# Altium schematic sheet LPCB234 - CAN.SchDoc
size A3; Address1: Factory 10; Address2: 9-13 Dingley Avenue, Dandeong, VICTORIA 3175, AUSTRALIA; DocumentNumber: 5; Revision: 1; SheetNumber: 5; SheetTotal: 10; Lockie__PCB_SUB_ASSEMBLY: CAN Interface; Lockie__PCB_ASSEMBLY: Main; Lockie__LDL: LPCB234; Lockie__PCB_DESCRIPTION: RM4 Power Node
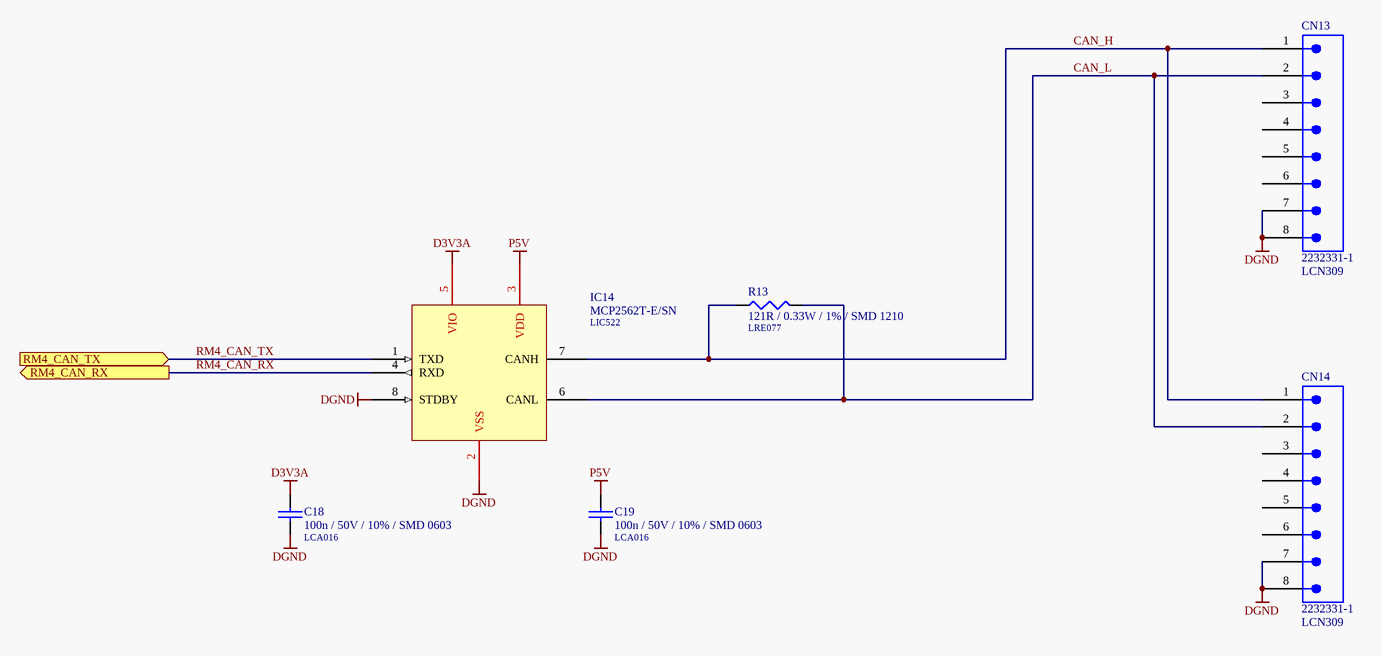
[diagram p0: LPCB234 - CAN.SchDoc]

## Parts
C18  100n / 50V / 10% / SMD 0603  LDL_NUMBER: LCA016  [LFP011__CC1608-0603-IPC7351_B]
C19  100n / 50V / 10% / SMD 0603  LDL_NUMBER: LCA016  [LFP011__CC1608-0603-IPC7351_B]
CN13  2232331-1  LDL_NUMBER: LCN309  [2232331-1]
CN14  2232331-1  LDL_NUMBER: LCN309  [2232331-1]
IC14  MCP2562T-E/SN  LDL_NUMBER: LIC522  [LFP017__SO-G8/Y1.9]
R13  121R / 0.33W / 1% / SMD 1210  LDL_NUMBER: LRE077  [LFP028__CR3225-1210]

## Ports
RM4_CAN_RX (out), RM4_CAN_TX (in)

## Nets
D3V3A: C18.1 IC14.5(VIO)
DGND: C18.2 C19.2 CN13.7 CN13.8 CN14.7 CN14.8 IC14.2(VSS) IC14.8(STDBY)
P5V: C19.1 IC14.3(VDD)
CAN_H: CN13.1 CN14.1 IC14.7(CANH) R13.1
CAN_L: CN13.2 CN14.2 IC14.6(CANL) R13.2
RM4_CAN_RX: IC14.4(RXD) ; port RM4_CAN_RX
RM4_CAN_TX: IC14.1(TXD) ; port RM4_CAN_TX

Not connected (* = marked no-connect by the designer): CN13 3 4 5 6; CN14 3 4 5 6

## Notes on the sheet
- PCB COMPONENT DESCRIPTION
- LDL NUMBER
- Assembly Details
- Size
- Drawing File Name
- Revision
- http://rloop.org
- Scale
- A3
- Sheet Details
- N.T.S
- Sheet:
- Of:

## Library data of the parts
C18 C19 = 100n / 50V / 10% / SMD 0603: Capacitor, Ceramic Chip, 100nF (0.1uF), 50V, 5%, SMD 0603 [LCA016]; FMEDA__OPERATING__VOLTAGE_MIN: 0; FMEDA__OPERATING__VOLTAGE_MAX: 3.3; FMEDA__OPERATING__TEMP_MIN: -20; FMEDA__OPERATING__TEMP_TYP: 27; FMEDA__OPERATING__TEMP_MAX: 50; FMEDA__CHANNEL: COM; Value: 100n; FMEDA__FUNCTION_IN_SYSTEM: *; FMEDA__OPERATING__VOLTAGE_TYP: 3.3
CN13 CN14 = 2232331-1: Connector, M12 8 Way, PCB Mount; FMEDA__CHANNEL: COM; FMEDA__OPERATING__CURRENT_MAX: 0; FMEDA__OPERATING__TEMP_MAX: 50; FMEDA__OPERATING__TEMP_MIN: -20; FMEDA__OPERATING__TEMP_TYP: 27; FMEDA__OPERATING__VOLTAGE_MAX: 16; FMEDA__OPERATING__VOLTAGE_TYP: 12; FMEDA__FUNCTION_IN_SYSTEM: *; FMEDA__OPERATING__CURRENT_MIN: 0; FMEDA__OPERATING__CURRENT_TYP: 0; FMEDA__OPERATING__VOLTAGE_MIN: 0
IC14 = MCP2562T-E/SN: IC, High Speed CAN Transceiver, SMD SOIC8 [LIC522]; FMEDA__OPERATING__TEMP_MAX: 50; FMEDA__OPERATING__TEMP_MIN: -20; FMEDA__OPERATING__TEMP_TYP: 27; FMEDA__OPERATING__VOLTAGE_MAX: 0; FMEDA__CHANNEL: COM; FMEDA__OPERATING__VOLTAGE_MIN: 0; FMEDA__OPERATING__VOLTAGE_TYP: 0; FMEDA__FUNCTION_IN_SYSTEM: *
R13 = 121R / 0.33W / 1% / SMD 1210: Resistor, Ceramic Chip, 121R, 0.33W, 1%, SMD 1210 [LRE077]; VALUE: 121; FMEDA__OPERATING__POWER_MAX: 0; FMEDA__OPERATING__TEMP_MAX: 50; FMEDA__OPERATING__TEMP_MIN: -20; FMEDA__OPERATING__TEMP_TYP: 27; FMEDA__CHANNEL: COM; FMEDA__OPERATING__POWER_MIN: 0; FMEDA__OPERATING__VOLTAGE_MAX: 0; FMEDA__OPERATING__VOLTAGE_MIN: 0; FMEDA__OPERATING__VOLTAGE_TYP: 0; FMEDA__FUNCTION_IN_SYSTEM: *